# Altium schematic sheet TOP.SchDoc
size A4; DocumentNumber: 1; SheetNumber: 1
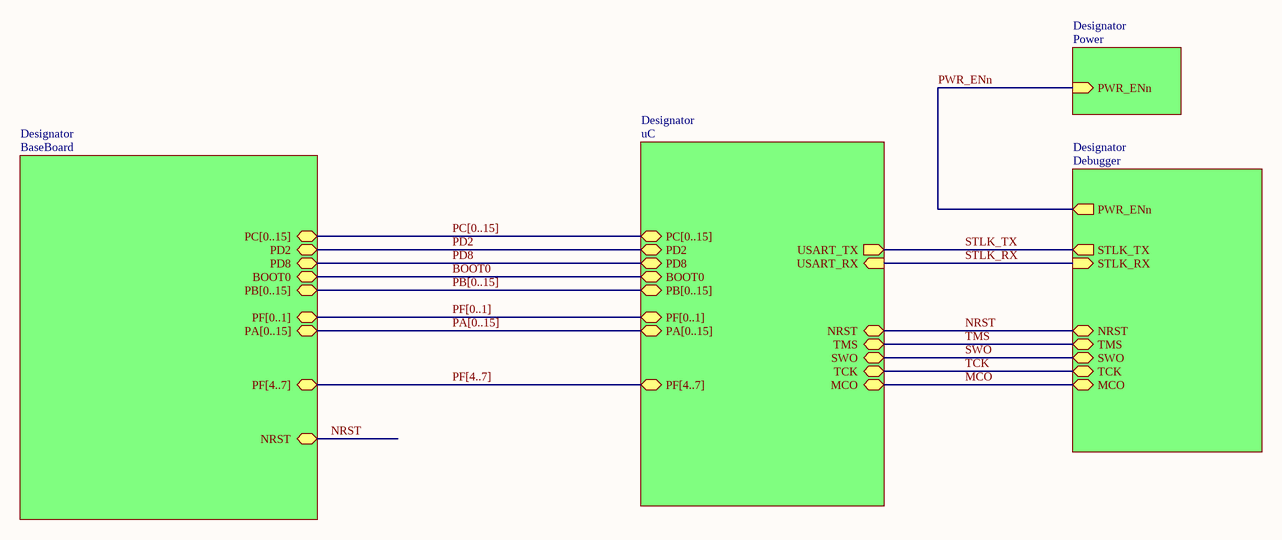
[diagram p0: TOP.SchDoc]

## Sub-sheets
Designator = Debugger: MCO, STLK_TX (out), STLK_RX (in), NRST, TMS, SWO, TCK, PWR_ENn (out)
Designator = uC: PC[0..15] (bidir), NRST, PD2, PD8, BOOT0, PB[0..15] (bidir), USART_RX (in), PF[0..1] (bidir), PA[0..15] (bidir), USART_TX (out), TCK, TMS, PF[4..7] (bidir), SWO, MCO
Designator = BaseBoard: PD8, BOOT0, PC[0..15] (bidir), PB[0..15] (bidir), NRST, PF[0..1] (bidir), PF[4..7] (bidir), PD2, PA[0..15] (bidir)
Designator = Power: PWR_ENn (in)

## Nets
BOOT0: sheet Designator/BOOT0, sheet Designator/BOOT0
MCO: sheet Designator/MCO, sheet Designator/MCO
NRST: sheet Designator/NRST, sheet Designator/NRST, sheet Designator/NRST
PD2: sheet Designator/PD2, sheet Designator/PD2
PD8: sheet Designator/PD8, sheet Designator/PD8
PWR_ENn: sheet Designator/PWR_ENn, sheet Designator/PWR_ENn
STLK_RX: sheet Designator/STLK_RX, sheet Designator/USART_RX
STLK_TX: sheet Designator/STLK_TX, sheet Designator/USART_TX
SWO: sheet Designator/SWO, sheet Designator/SWO
TCK: sheet Designator/TCK, sheet Designator/TCK
TMS: sheet Designator/TMS, sheet Designator/TMS

## Buses and harness runs
bus PA[0..15] = sheet Designator/PA[0..15]
bus PB[0..15] = sheet Designator/PB[0..15]
bus PC[0..15] = sheet Designator/PC[0..15]
bus PF[0..1] = sheet Designator/PF[0..1]
bus PF[4..7] = sheet Designator/PF[4..7]